# EAGLE schematic blades_v40 (EAGLE 5.09)

## Sheet 1 of 6
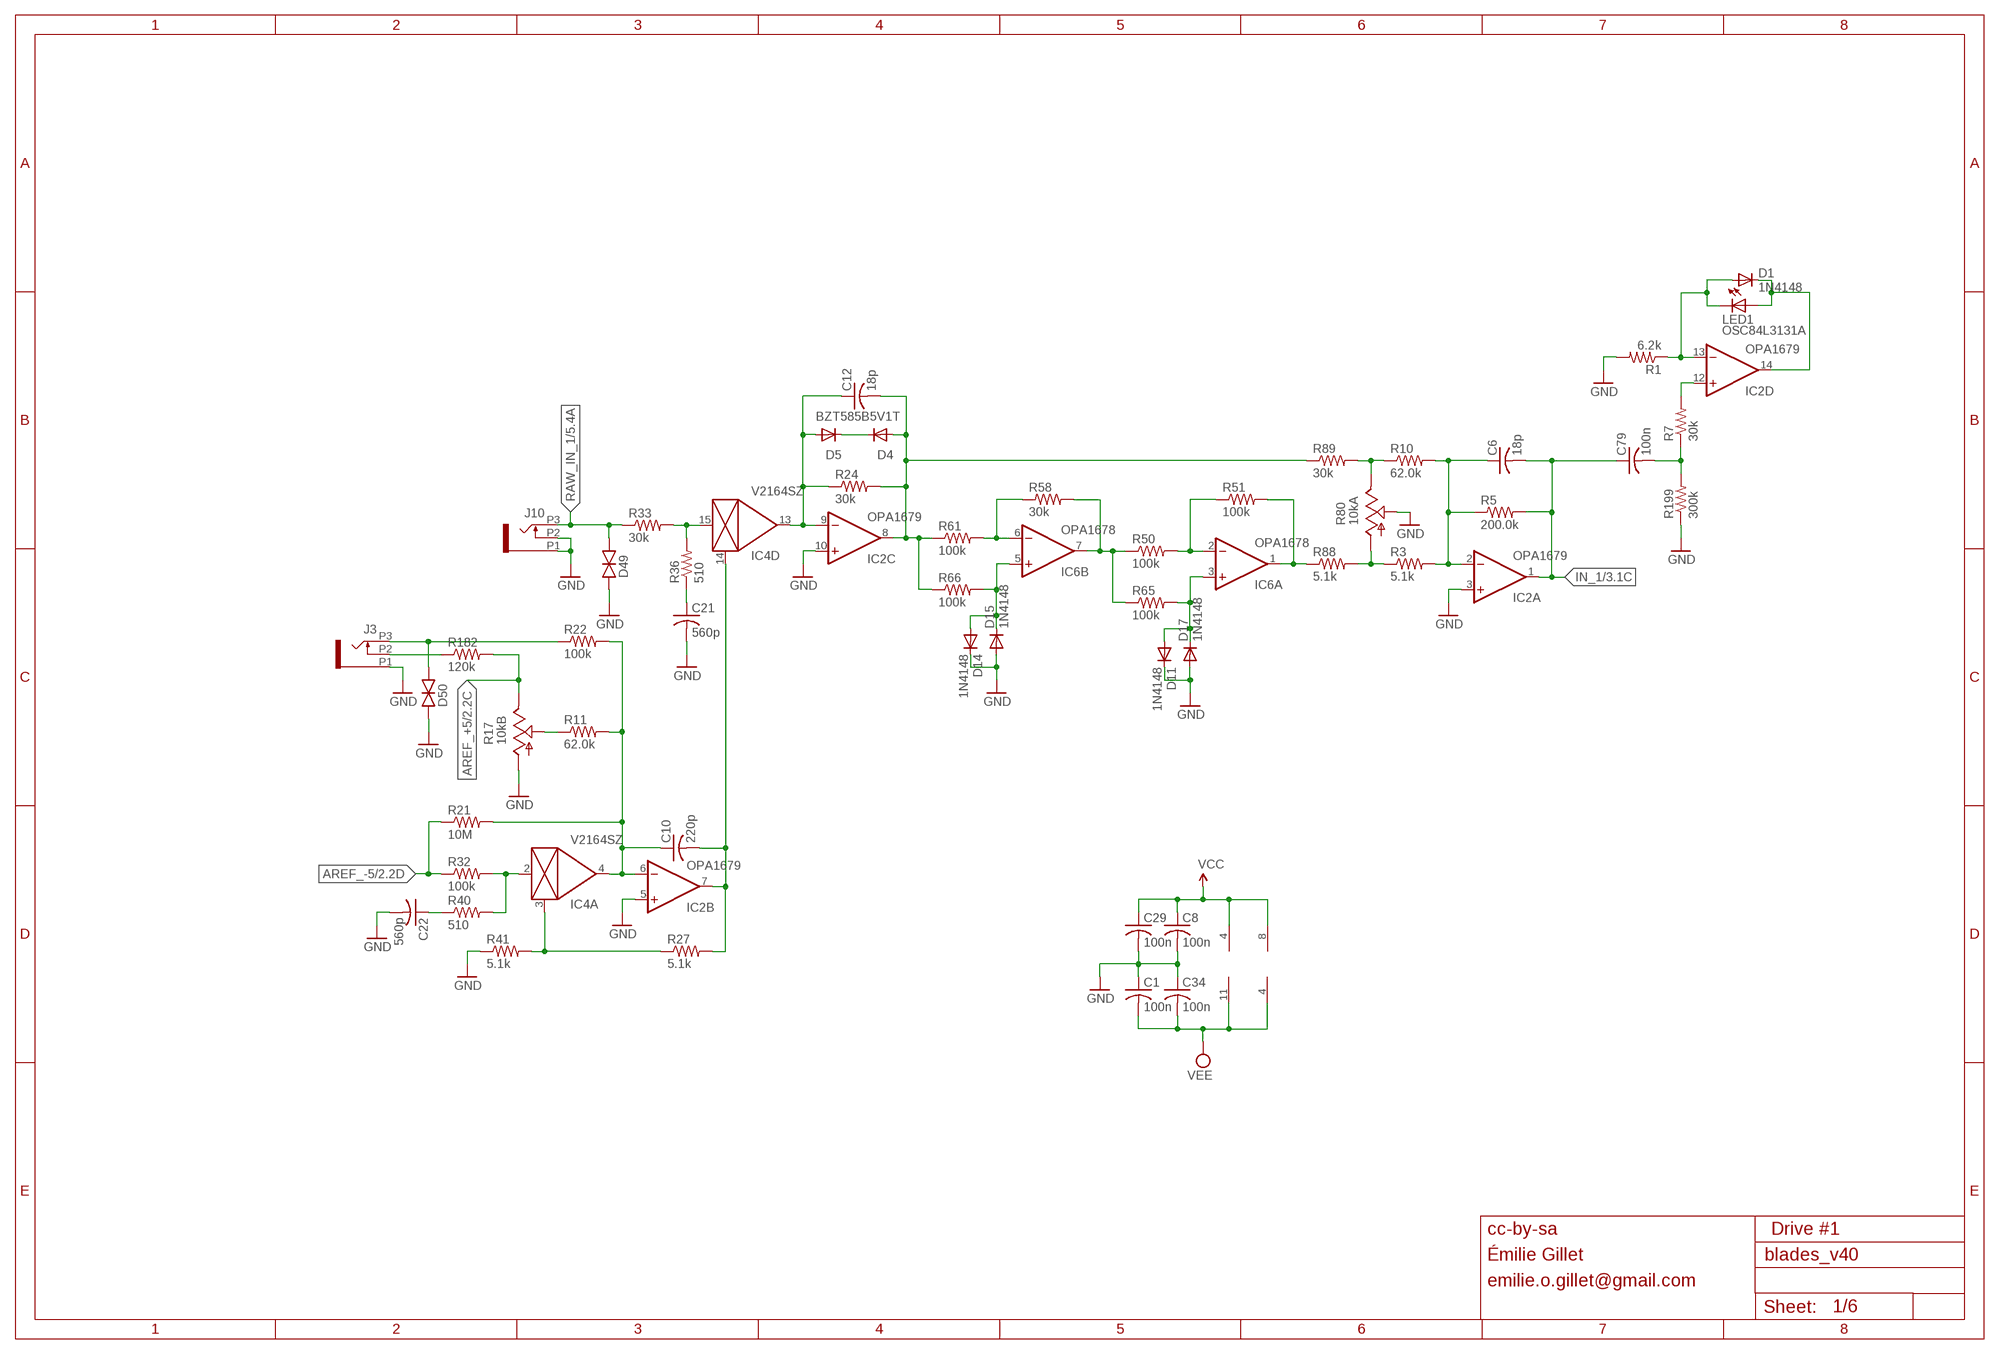
[diagram p0: schematic, sheet 1]

### Parts
C1  100n  C-USC0402  [C0402]
C6  18p  C-USC0402  [C0402]
C8  100n  C-USC0402  [C0402]
C10  220p  C-USC0402  [C0402]
C12  18p  C-USC0402  [C0402]
C21  560p  C-USC0402  [C0402]
C22  560p  C-USC0402  [C0402]
C29  100n  C-USC0402  [C0402]
C34  100n  C-USC0402  [C0402]
C79  100n  C-USC0402  [C0402]
D1  1N4148  DIODE-SOD523  [SOD523]
D4  BZT585B5V1T  DIODE-SOD523  [SOD523]
D5  BZT585B5V1T  DIODE-SOD523  [SOD523]
D11  1N4148  DIODE-SOD523  [SOD523]
D14  1N4148  DIODE-SOD523  [SOD523]
D15  1N4148  DIODE-SOD523  [SOD523]
D17  1N4148  DIODE-SOD523  [SOD523]
D49  TVS  [0603]
D50  TVS  [0603]
IC2  OPA1679  OPA1679PW  [TSSOP14_065]
IC4  V2164SZ  SSM2164S  [SOIC16N]
IC6  OPA1678  OPA1678DGK  [VSSOP8]
J3  PJ301_THONKICONNTME  [WQP_PJ_301M_TME]
J10  PJ301_THONKICONNTME  [WQP_PJ_301M_TME]
LED1  OSC84L3131A  LED3MM  [LED3MM]
R1  6.2k  R-US_R0402  [R0402]
R3  5.1k  R-US_R0402  [R0402]
R5  200.0k  R-US_R0402  [R0402]
R7  30k  R-US_R0402  [R0402]
R10  62.0k  R-US_R0402  [R0402]
R11  62.0k  R-US_R0402  [R0402]
R17  10kB  POT_USVERTICAL_PS  [ALPS_POT_VERTICAL_PS]
R21  10M  R-US_R0402  [R0402]
R22  100k  R-US_R0402  [R0402]
R24  30k  R-US_R0402  [R0402]
R27  5.1k  R-US_R0402  [R0402]
R32  100k  R-US_R0402  [R0402]
R33  30k  R-US_R0402  [R0402]
R36  510  R-US_R0402  [R0402]
R40  510  R-US_R0402  [R0402]
R41  5.1k  R-US_R0402  [R0402]
R50  100k  R-US_R0402  [R0402]
R51  100k  R-US_R0402  [R0402]
R58  30k  R-US_R0402  [R0402]
R61  100k  R-US_R0402  [R0402]
R65  100k  R-US_R0402  [R0402]
R66  100k  R-US_R0402  [R0402]
R80  10kA  POT_USVERTICAL_NARROW  [ALPS_POT_NARROW]
R88  5.1k  R-US_R0402  [R0402]
R89  30k  R-US_R0402  [R0402]
R182  120k  R-US_R0402  [R0402]
R199  300k  R-US_R0402  [R0402]

### Nets
AREF_+5: R17.P$1(E) R182.2 ; also sheet 2,3,4,5,6
AREF_-5: R21.1 R32.1 ; also sheet 2,3,4,5,6
DRIVE_1: C12.2 D4.A IC2.8(C:OUT) R24.2 R61.1 R66.1 R89.1
GND: C1.1 C8.2 C21.2 C22.2 C29.2 C34.1 D11.C D14.C D15.A D17.A D49.1(A) D50.1(A) IC2.3(A:+IN) IC2.5(B:+IN) IC2.10(C:+IN) J3.P1 J10.P1 J10.P2 R1.2 R17.P$3(A) R41.1 R80.P$2(S) R199.1 ; also sheet 2,3,4,5,6
IN_1: C6.2 C79.1 IC2.1(A:OUT) R5.2 ; also sheet 3
MORPH_1A1: C10.2 IC2.7(B:OUT) IC4.14(D:CTRL) R27.2
N$3: D4.C D5.C
N$4: C21.1 R36.1
N$15: C79.2 R7.1 R199.2
N$22: IC4.2(A:IN) R32.2 R40.2
N$31: IC2.12(D:+IN) R7.2
N$38: R10.1 R80.P$1(E) R89.2
N$43: IC6.6(B:-IN) R58.1 R61.2
N$44: D50.2(C) J3.P3 R22.1
N$45: C10.1 IC2.6(B:-IN) IC4.4(A:OUT) R11.2 R21.2 R22.2
N$48: R3.1 R80.P$3(A) R88.2
N$49: C6.1 IC2.2(A:-IN) R3.2 R5.1 R10.2
N$51: R11.1 R17.P$2(S)
N$63: IC4.3(A:CTRL) R27.1 R41.2
N$64: J3.P2 R182.1
N$84: C22.1 R40.1
N$87: IC4.15(D:IN) R33.2 R36.2
N$101: D1.A IC2.13(D:-IN) LED1.K(C) R1.1
N$108: C12.1 D5.A IC2.9(C:-IN) IC4.13(D:OUT) R24.1
N$127: D14.A D15.C IC6.5(B:+IN) R66.2
N$129: D1.C IC2.14(D:OUT) LED1.A
N$185: IC6.7(B:OUT) R50.1 R58.2 R65.1
N$186: IC6.2(A:-IN) R50.2 R51.1
N$187: IC6.1(A:OUT) R51.2 R88.1
N$188: D11.A D17.C IC6.3(A:+IN) R65.2
RAW_IN_1: D49.2(C) J10.P3 R33.1 ; also sheet 5
VCC: C8.1 C29.1 IC2.4(P:V+) IC6.8(P:V+) ; also sheet 2,3,4,5,6
VEE: C1.2 C34.2 IC2.11(P:V-) IC6.4(P:V-) ; also sheet 2,3,4,5,6

### Notes on the sheet
- cc-by-sa | Drive #1
- Émilie Gillet
- emilie.o.gillet@gmail.com

## Sheet 2 of 6
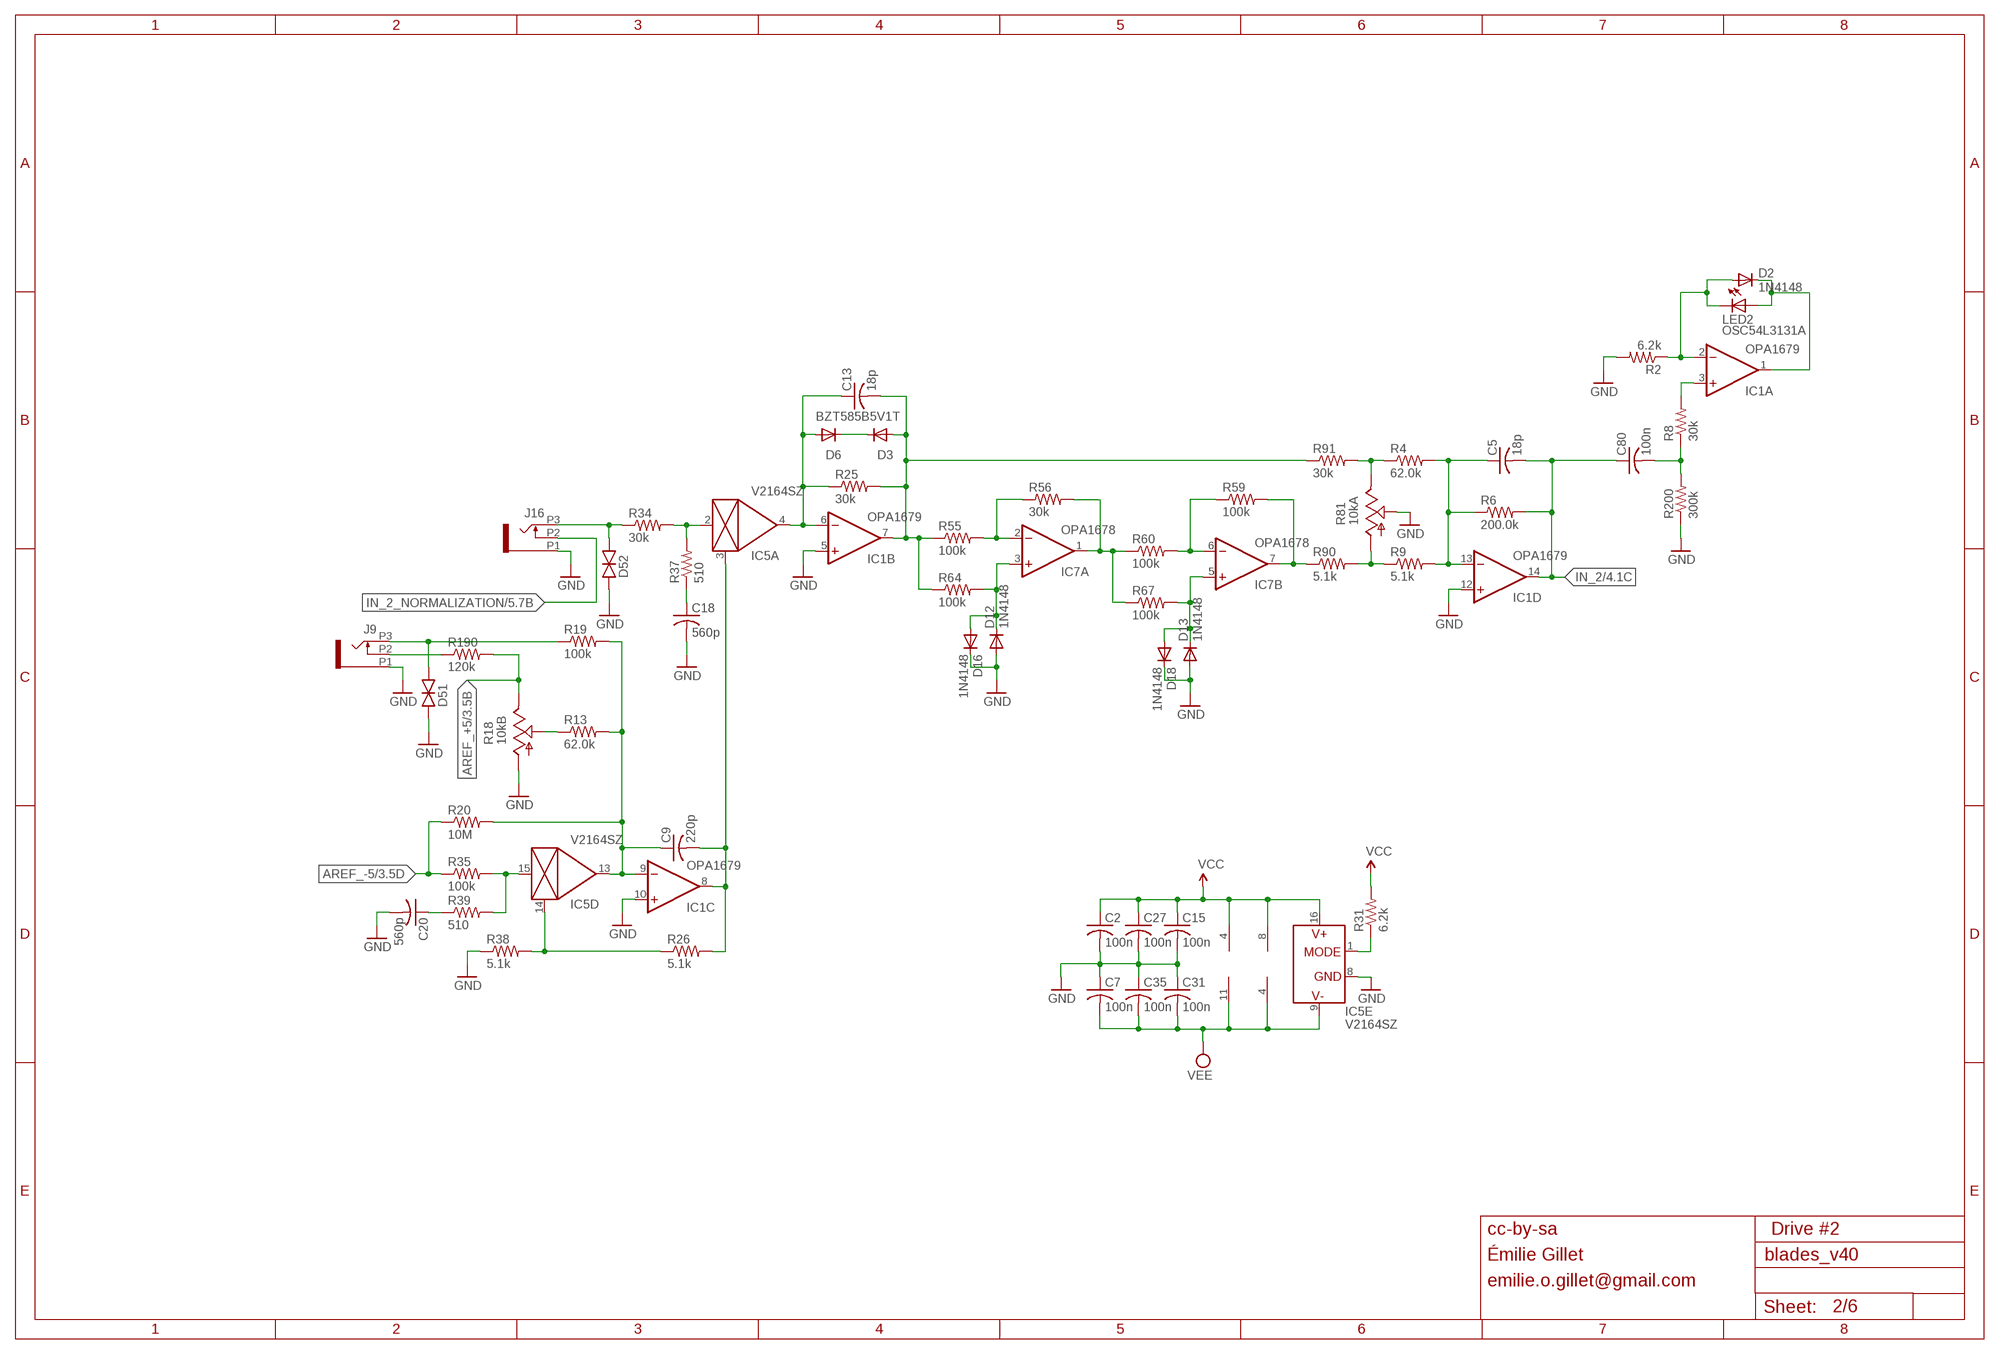
[diagram p1: schematic, sheet 2]

### Parts
C2  100n  C-USC0402  [C0402]
C5  18p  C-USC0402  [C0402]
C7  100n  C-USC0402  [C0402]
C9  220p  C-USC0402  [C0402]
C13  18p  C-USC0402  [C0402]
C15  100n  C-USC0402  [C0402]
C18  560p  C-USC0402  [C0402]
C20  560p  C-USC0402  [C0402]
C27  100n  C-USC0402  [C0402]
C31  100n  C-USC0402  [C0402]
C35  100n  C-USC0402  [C0402]
C80  100n  C-USC0402  [C0402]
D2  1N4148  DIODE-SOD523  [SOD523]
D3  BZT585B5V1T  DIODE-SOD523  [SOD523]
D6  BZT585B5V1T  DIODE-SOD523  [SOD523]
D12  1N4148  DIODE-SOD523  [SOD523]
D13  1N4148  DIODE-SOD523  [SOD523]
D16  1N4148  DIODE-SOD523  [SOD523]
D18  1N4148  DIODE-SOD523  [SOD523]
D51  TVS  [0603]
D52  TVS  [0603]
IC1  OPA1679  OPA1679PW  [TSSOP14_065]
IC5  V2164SZ  SSM2164S  [SOIC16N]
IC7  OPA1678  OPA1678DGK  [VSSOP8]
J9  PJ301_THONKICONNTME  [WQP_PJ_301M_TME]
J16  PJ301_THONKICONNTME  [WQP_PJ_301M_TME]
LED2  OSC54L3131A  LED3MM  [LED3MM]
R2  6.2k  R-US_R0402  [R0402]
R4  62.0k  R-US_R0402  [R0402]
R6  200.0k  R-US_R0402  [R0402]
R8  30k  R-US_R0402  [R0402]
R9  5.1k  R-US_R0402  [R0402]
R13  62.0k  R-US_R0402  [R0402]
R18  10kB  POT_USVERTICAL_PS  [ALPS_POT_VERTICAL_PS]
R19  100k  R-US_R0402  [R0402]
R20  10M  R-US_R0402  [R0402]
R25  30k  R-US_R0402  [R0402]
R26  5.1k  R-US_R0402  [R0402]
R31  6.2k  R-US_R0402  [R0402]
R34  30k  R-US_R0402  [R0402]
R35  100k  R-US_R0402  [R0402]
R37  510  R-US_R0402  [R0402]
R38  5.1k  R-US_R0402  [R0402]
R39  510  R-US_R0402  [R0402]
R55  100k  R-US_R0402  [R0402]
R56  30k  R-US_R0402  [R0402]
R59  100k  R-US_R0402  [R0402]
R60  100k  R-US_R0402  [R0402]
R64  100k  R-US_R0402  [R0402]
R67  100k  R-US_R0402  [R0402]
R81  10kA  POT_USVERTICAL_NARROW  [ALPS_POT_NARROW]
R90  5.1k  R-US_R0402  [R0402]
R91  30k  R-US_R0402  [R0402]
R190  120k  R-US_R0402  [R0402]
R200  300k  R-US_R0402  [R0402]

### Nets
AREF_+5: R18.P$1(E) R190.2 ; also sheet 1,3,4,5,6
AREF_-5: R20.1 R35.1 ; also sheet 1,3,4,5,6
DRIVE_2: C13.2 D3.A IC1.7(B:OUT) R25.2 R55.1 R64.1 R91.1
GND: C2.2 C7.1 C15.2 C18.2 C20.2 C27.2 C31.1 C35.1 D12.A D13.A D16.C D18.C D51.1(A) D52.1(A) IC1.5(B:+IN) IC1.10(C:+IN) IC1.12(D:+IN) IC5.8(E:GND) J9.P1 J16.P1 R2.2 R18.P$3(A) R38.1 R81.P$2(S) R200.1 ; also sheet 1,3,4,5,6
IN_1LED1: IC1.3(A:+IN) R8.2
IN_2: C5.2 C80.1 IC1.14(D:OUT) R6.2 ; also sheet 4
IN_2_NORMALIZATION: J16.P2 ; also sheet 5
MORPH_1A2: C9.2 IC1.8(C:OUT) IC5.3(A:CTRL) R26.2
N$29: D2.A IC1.2(A:-IN) LED2.K(C) R2.1
N$33: R13.1 R18.P$2(S)
N$41: IC7.2(A:-IN) R55.2 R56.1
N$59: D12.C D16.A IC7.3(A:+IN) R64.2
N$68: IC7.1(A:OUT) R56.2 R60.1 R67.1
N$69: IC7.6(B:-IN) R59.1 R60.2
N$70: J9.P2 R190.1
N$82: IC7.7(B:OUT) R59.2 R90.1
N$99: D51.2(C) J9.P3 R19.1
N$100: C5.1 IC1.13(D:-IN) R4.2 R6.1 R9.2
N$107: IC5.1(E:MODE) R31.1
N$116: C80.2 R8.1 R200.2
N$118: D2.C IC1.1(A:OUT) LED2.A
N$119: C9.1 IC1.9(C:-IN) IC5.13(D:OUT) R13.2 R19.2 R20.2
N$120: IC5.14(D:CTRL) R26.1 R38.2
N$121: IC5.15(D:IN) R35.2 R39.2
N$122: C20.1 R39.1
N$123: C18.1 R37.1
N$124: IC5.2(A:IN) R34.2 R37.2
N$126: C13.1 D6.A IC1.6(B:-IN) IC5.4(A:OUT) R25.1
N$154: D13.C D18.A IC7.5(B:+IN) R67.2
N$157: R4.1 R81.P$1(E) R91.2
N$174: R9.1 R81.P$3(A) R90.2
N$182: D3.C D6.C
RAW_IN_2: D52.2(C) J16.P3 R34.1
VCC: C2.1 C15.1 C27.1 IC1.4(P:V+) IC5.16(E:V+) IC7.8(P:V+) R31.2 ; also sheet 1,3,4,5,6
VEE: C7.2 C31.2 C35.2 IC1.11(P:V-) IC5.9(E:V-) IC7.4(P:V-) ; also sheet 1,3,4,5,6

### Notes on the sheet
- cc-by-sa | Drive #2
- Émilie Gillet
- emilie.o.gillet@gmail.com

## Sheet 3 of 6
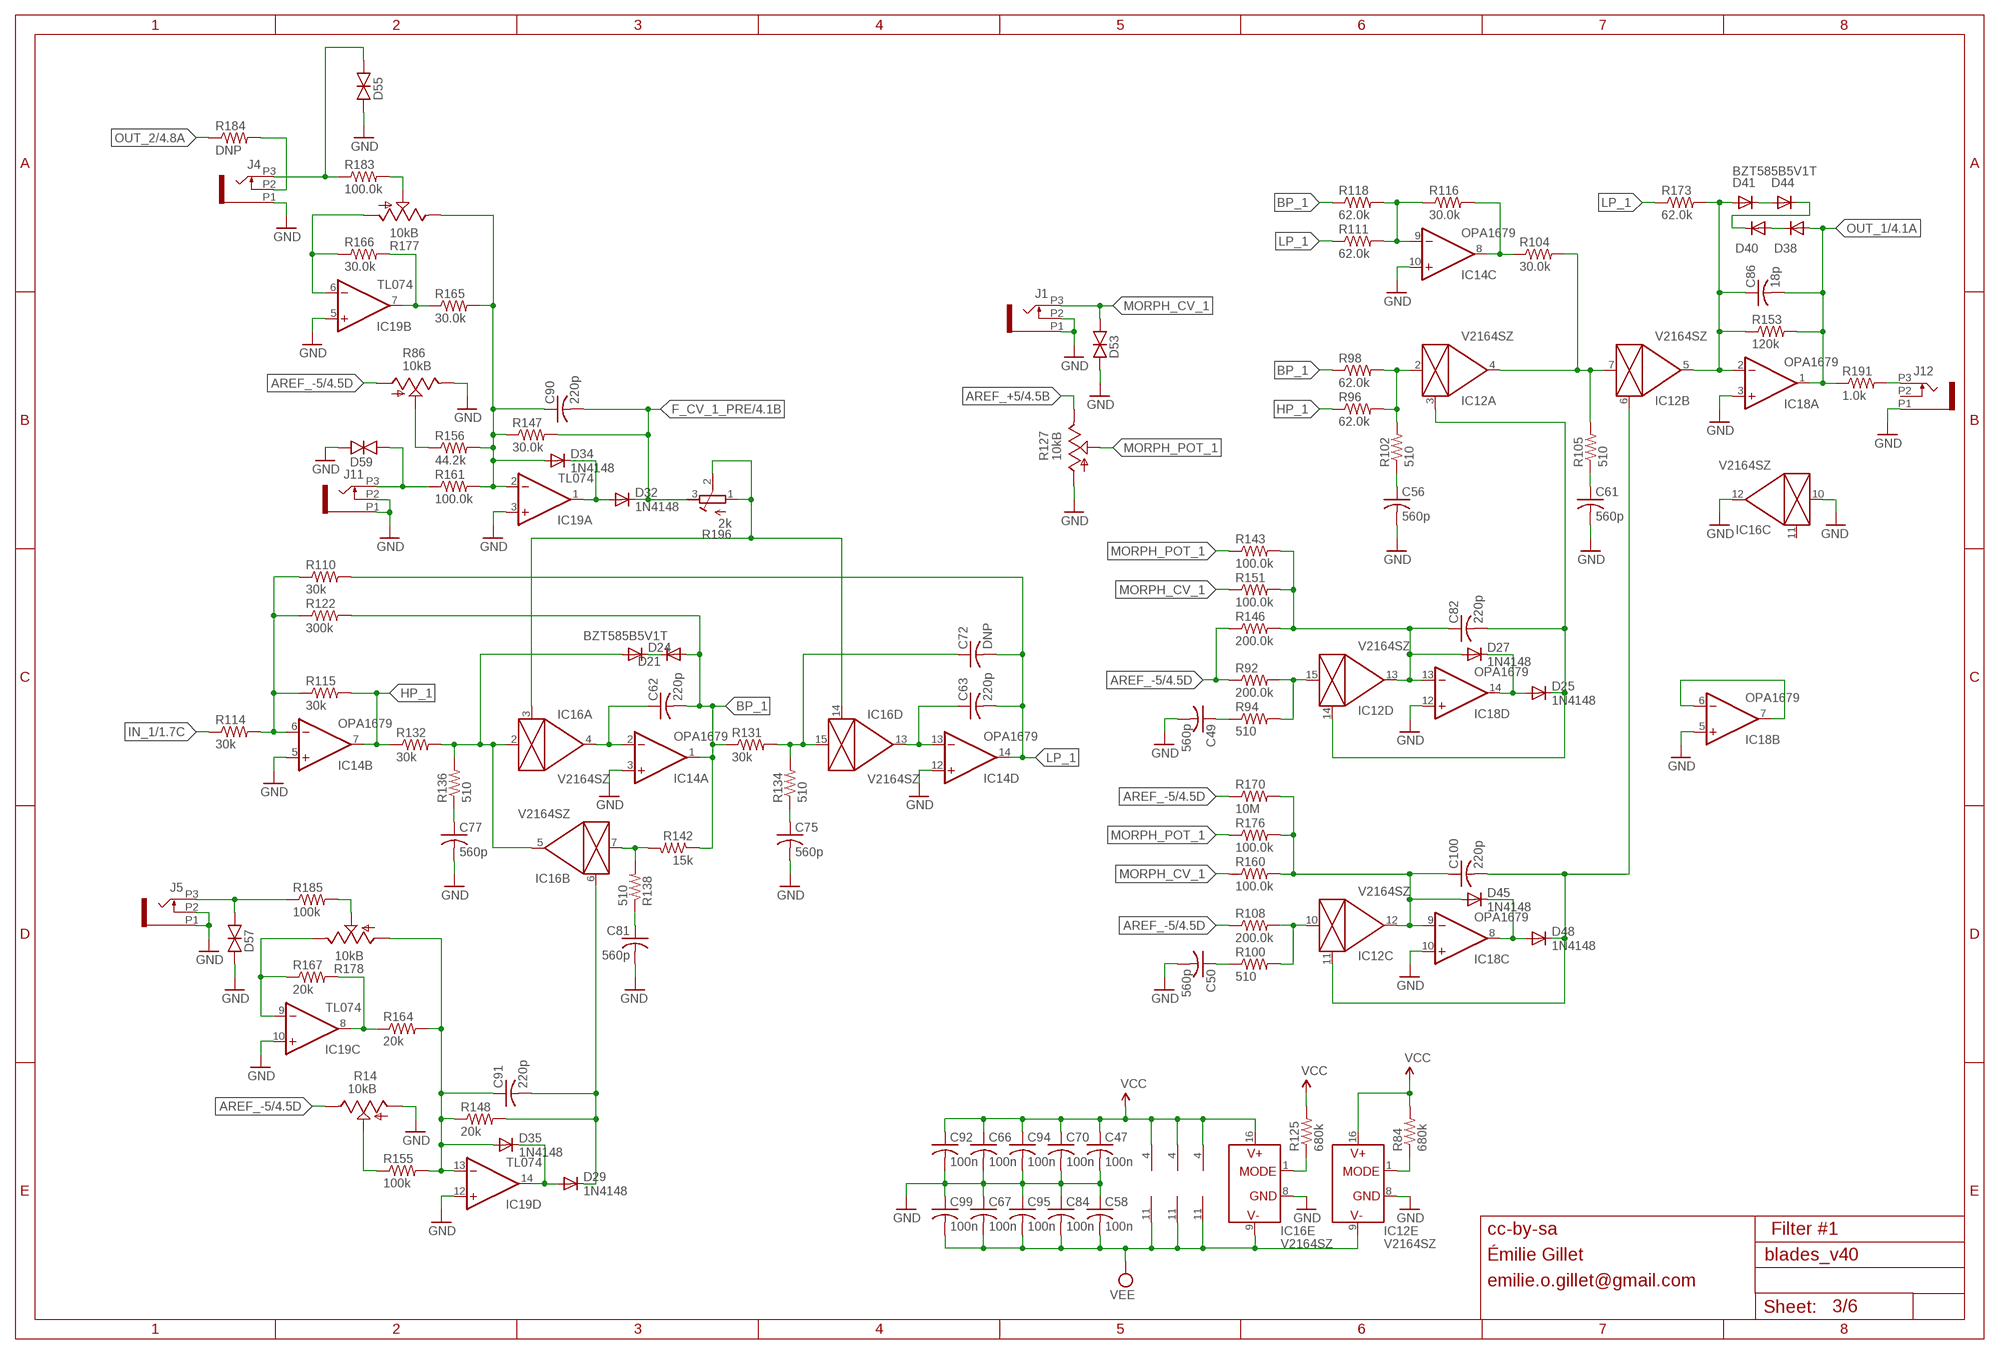
[diagram p2: schematic, sheet 3]

### Parts
C47  100n  C-USC0402  [C0402]
C49  560p  C-USC0402  [C0402]
C50  560p  C-USC0402  [C0402]
C56  560p  C-USC0402  [C0402]
C58  100n  C-USC0402  [C0402]
C61  560p  C-USC0402  [C0402]
C62  220p  C-USC0402  [C0402]
C63  220p  C-USC0402  [C0402]
C66  100n  C-USC0402  [C0402]
C67  100n  C-USC0402  [C0402]
C70  100n  C-USC0402  [C0402]
C72  DNP  C-USC0402  [C0402]
C75  560p  C-USC0402  [C0402]
C77  560p  C-USC0402  [C0402]
C81  560p  C-USC0402  [C0402]
C82  220p  C-USC0402  [C0402]
C84  100n  C-USC0402  [C0402]
C86  18p  C-USC0402  [C0402]
C90  220p  C-USC0402  [C0402]
C91  220p  C-USC0402  [C0402]
C92  100n  C-USC0402  [C0402]
C94  100n  C-USC0402  [C0402]
C95  100n  C-USC0402  [C0402]
C99  100n  C-USC0402  [C0402]
C100  220p  C-USC0402  [C0402]
D21  BZT585B5V1T  DIODE-SOD523  [SOD523]
D24  BZT585B5V1T  DIODE-SOD523  [SOD523]
D25  1N4148  DIODE-SOD523  [SOD523]
D27  1N4148  DIODE-SOD523  [SOD523]
D29  1N4148  DIODE-SOD523  [SOD523]
D32  1N4148  DIODE-SOD523  [SOD523]
D34  1N4148  DIODE-SOD523  [SOD523]
D35  1N4148  DIODE-SOD523  [SOD523]
D38  BZT585B5V1T  DIODE-SOD523  [SOD523]
D40  BZT585B5V1T  DIODE-SOD523  [SOD523]
D41  BZT585B5V1T  DIODE-SOD523  [SOD523]
D44  BZT585B5V1T  DIODE-SOD523  [SOD523]
D45  1N4148  DIODE-SOD523  [SOD523]
D48  1N4148  DIODE-SOD523  [SOD523]
D53  TVS  [0603]
D55  TVS  [0603]
D57  TVS  [0603]
D59  TVS  [0603]
IC12  V2164SZ  SSM2164S  [SOIC16N]
IC14  OPA1679  OPA1679PW  [TSSOP14_065]
IC16  V2164SZ  SSM2164S  [SOIC16N]
IC18  OPA1679  OPA1679PW  [TSSOP14_065]
IC19  TL074  TL074PW  [TSSOP14_065]
J1  PJ301_THONKICONNTME  [WQP_PJ_301M_TME]
J4  PJ301_THONKICONNTME  [WQP_PJ_301M_TME]
J5  PJ301_THONKICONNTME  [WQP_PJ_301M_TME]
J11  PJ301_THONKICONNTME  [WQP_PJ_301M_TME]
J12  PJ301_THONKICONNTME  [WQP_PJ_301M_TME]
R14  10kB  POT_USVERTICAL_PS  [ALPS_POT_VERTICAL_PS]
R84  680k  R-US_R0402  [R0402]
R86  10kB  POT_USVERTICAL_PS  [ALPS_POT_VERTICAL_PS]
R92  200.0k  R-US_R0402  [R0402]
R94  510  R-US_R0402  [R0402]
R96  62.0k  R-US_R0402  [R0402]
R98  62.0k  R-US_R0402  [R0402]
R100  510  R-US_R0402  [R0402]
R102  510  R-US_R0402  [R0402]
R104  30.0k  R-US_R0402  [R0402]
R105  510  R-US_R0402  [R0402]
R108  200.0k  R-US_R0402  [R0402]
R110  30k  R-US_R0402  [R0402]
R111  62.0k  R-US_R0402  [R0402]
R114  30k  R-US_R0402  [R0402]
R115  30k  R-US_R0402  [R0402]
R116  30.0k  R-US_R0402  [R0402]
R118  62.0k  R-US_R0402  [R0402]
R122  300k  R-US_R0402  [R0402]
R125  680k  R-US_R0402  [R0402]
R127  10kB  POT_USVERTICAL_PS  [ALPS_POT_VERTICAL_PS]
R131  30k  R-US_R0402  [R0402]
R132  30k  R-US_R0402  [R0402]
R134  510  R-US_R0402  [R0402]
R136  510  R-US_R0402  [R0402]
R138  510  R-US_R0402  [R0402]
R142  15k  R-US_R0402  [R0402]
R143  100.0k  R-US_R0402  [R0402]
R146  200.0k  R-US_R0402  [R0402]
R147  30.0k  R-US_R0402  [R0402]
R148  20k  R-US_R0402  [R0402]
R151  100.0k  R-US_R0402  [R0402]
R153  120k  R-US_R0402  [R0402]
R155  100k  R-US_R0402  [R0402]
R156  44.2k  R-US_R0402  [R0402]
R160  100.0k  R-US_R0402  [R0402]
R161  100.0k  R-US_R0402  [R0402]
R164  20k  R-US_R0402  [R0402]
R165  30.0k  R-US_R0402  [R0402]
R166  30.0k  R-US_R0402  [R0402]
R167  20k  R-US_R0402  [R0402]
R170  10M  R-US_R0402  [R0402]
R173  62.0k  R-US_R0402  [R0402]
R176  100.0k  R-US_R0402  [R0402]
R177  10kB  POT_USVERTICAL_NARROW  [ALPS_POT_NARROW]
R178  10kB  POT_USVERTICAL_NARROW  [ALPS_POT_NARROW]
R183  100.0k  R-US_R0402  [R0402]
R184  DNP  R-US_R0603  [R0603]
R185  100k  R-US_R0402  [R0402]
R191  1.0k  R-US_R0603  [R0603]
R196  2k  R-TRIMM3296W  [RTRIM3296W]

### Nets
AREF_+5: R127.P$1(E) ; also sheet 1,2,4,5,6
AREF_-5: R14.P$1(E) R86.P$3(A) R92.1 R108.1 R146.1 R170.1 ; also sheet 1,2,4,5,6
BP_1: C62.2 D21.A IC14.1(A:OUT) R98.1 R118.1 R122.2 R131.1 R142.1
F_CV_1: IC16.3(A:CTRL) IC16.14(D:CTRL) R196.1(E) R196.2(S)
F_CV_1_PRE: C90.2 D32.C R147.2 R196.3(A) ; also sheet 4
GND: C47.2 C49.2 C50.2 C56.2 C58.1 C61.2 C66.2 C67.1 C70.2 C75.2 C77.2 C81.2 C84.1 C92.2 C94.2 C95.1 C99.1 D53.1(A) D55.1(A) D57.1(A) D59.1(A) IC12.8(E:GND) IC14.3(A:+IN) IC14.5(B:+IN) IC14.10(C:+IN) IC14.12(D:+IN) IC16.8(E:GND) IC16.10(C:IN) IC16.12(C:OUT) IC18.3(A:+IN) IC18.5(B:+IN) IC18.10(C:+IN) IC18.12(D:+IN) IC19.3(A:+IN) IC19.5(B:+IN) IC19.10(C:+IN) IC19.12(D:+IN) J1.P1 J1.P2 J4.P1 J5.P1 J5.P2 J11.P1 J11.P2 J12.P1 R14.P$3(A) R86.P$1(E) R127.P$3(A) ; also sheet 1,2,4,5,6
HP_1: IC14.7(B:OUT) R96.1 R115.2 R132.1
IN_1: R114.1 ; also sheet 1
LP_1: C63.2 C72.2 IC14.14(D:OUT) R110.2 R111.1 R173.1
MORPH_1A: C82.2 D25.C IC12.3(A:CTRL) IC12.14(D:CTRL)
MORPH_1B: C100.2 D48.C IC12.6(B:CTRL) IC12.11(C:CTRL)
MORPH_CV_1: D53.2(C) J1.P3 R151.1 R160.1
MORPH_POT_1: R127.P$2(S) R143.1 R176.1
N$7: C77.1 R136.1
N$8: J12.P3 R191.2
N$12: C90.1 D34.A IC19.2(A:-IN) R147.1 R156.2 R161.2 R165.2 R177.P$1(E)
N$20: C91.1 D35.A IC19.13(D:-IN) R148.1 R155.2 R164.2 R178.P$3(A)
N$21: D32.A D34.C IC19.1(A:OUT)
N$25: R86.P$2(S) R156.1
N$28: IC19.9(C:-IN) R167.1 R178.P$1(E)
N$30: IC19.8(C:OUT) R164.1 R167.2
N$32: R178.P$2(S) R185.2
N$35: C100.1 D45.A IC12.12(C:OUT) IC18.9(C:-IN) R160.2 R170.2 R176.2
N$36: IC14.6(B:-IN) R110.1 R114.2 R115.1 R122.1
N$39: C62.1 IC14.2(A:-IN) IC16.4(A:OUT)
N$40: C75.1 R134.1
N$42: C72.1 IC16.15(D:IN) R131.2 R134.2
N$46: C63.1 IC14.13(D:-IN) IC16.13(D:OUT)
N$47: C81.1 R138.1
N$50: IC16.7(B:IN) R138.2 R142.2
N$52: D57.2(C) J5.P3 R185.1
N$55: D29.A D35.C IC19.14(D:OUT)
N$57: IC18.6(B:-IN) IC18.7(B:OUT)
N$60: J4.P2 R184.2
N$66: R14.P$2(S) R155.1
N$72: IC12.2(A:IN) R96.2 R98.2 R102.2
N$73: IC14.9(C:-IN) R111.2 R116.1 R118.2
N$74: IC14.8(C:OUT) R104.1 R116.2
N$78: IC12.4(A:OUT) IC12.7(B:IN) R104.2 R105.2
N$79: C56.1 R102.1
N$80: C61.1 R105.1
N$81: D45.C D48.A IC18.8(C:OUT)
N$86: IC12.10(C:IN) R100.2 R108.2
N$88: IC19.6(B:-IN) R166.1 R177.P$3(A)
N$89: IC19.7(B:OUT) R165.1 R166.2
N$90: R177.P$2(S) R183.2
N$92: D55.2(C) J4.P3 R183.1
N$93: D59.2(C) J11.P3 R161.1
N$103: C50.1 R100.1
N$104: IC12.15(D:IN) R92.2 R94.2
N$105: C49.1 R94.1
N$109: C82.1 D27.A IC12.13(D:OUT) IC18.13(D:-IN) R143.2 R146.2 R151.2
N$110: D25.A D27.C IC18.14(D:OUT)
N$111: IC12.1(E:MODE) R84.1
N$112: IC16.1(E:MODE) R125.1
N$113: D21.C D24.C
N$114: C86.1 D41.A IC12.5(B:OUT) IC18.2(A:-IN) R153.1 R173.2
N$115: D38.C D40.A
N$128: D24.A IC16.2(A:IN) IC16.5(B:OUT) R132.2 R136.2
N$189: D40.C D44.C
N$190: D41.C D44.A
OUT_1: C86.2 D38.A IC18.1(A:OUT) R153.2 R191.1 ; also sheet 4,5
OUT_2: R184.1 ; also sheet 4,5
RESONANCE_SUM_1: C91.2 D29.C IC16.6(B:CTRL) R148.2
VCC: C47.1 C66.1 C70.1 C92.1 C94.1 IC12.16(E:V+) IC14.4(P:V+) IC16.16(E:V+) IC18.4(P:V+) IC19.4(P:V+) R84.2 R125.2 ; also sheet 1,2,4,5,6
VEE: C58.2 C67.2 C84.2 C95.2 C99.2 IC12.9(E:V-) IC14.11(P:V-) IC16.9(E:V-) IC18.11(P:V-) IC19.11(P:V-) ; also sheet 1,2,4,5,6
Unconnected: IC16.11(C:CTRL) J12.P2

### Notes on the sheet
- cc-by-sa | Filter #1
- Émilie Gillet
- emilie.o.gillet@gmail.com

## Sheet 4 of 6
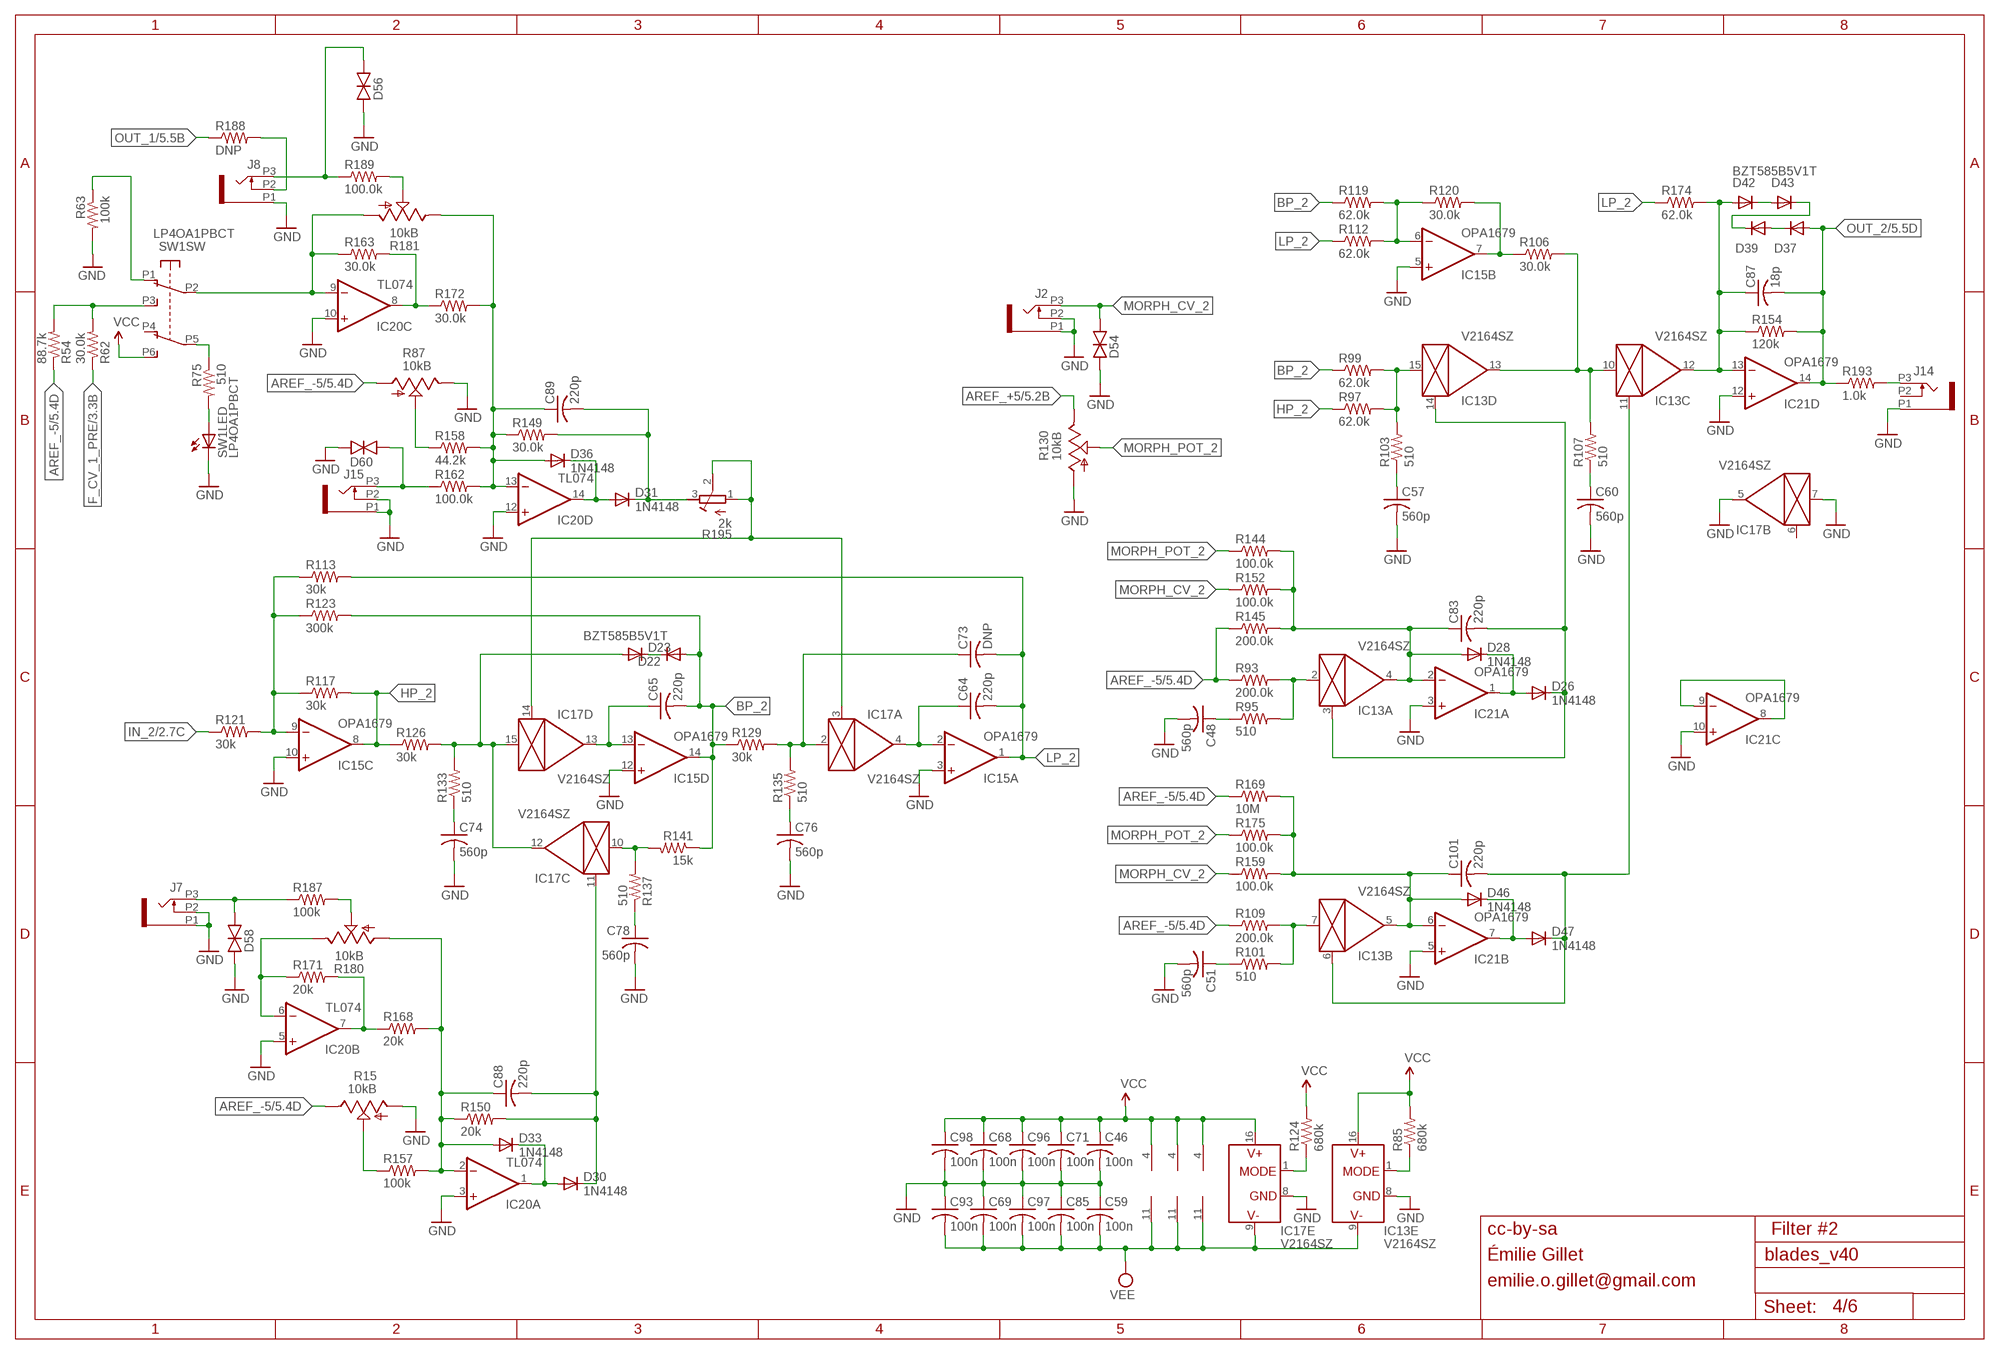
[diagram p3: schematic, sheet 4]

### Parts
C46  100n  C-USC0402  [C0402]
C48  560p  C-USC0402  [C0402]
C51  560p  C-USC0402  [C0402]
C57  560p  C-USC0402  [C0402]
C59  100n  C-USC0402  [C0402]
C60  560p  C-USC0402  [C0402]
C64  220p  C-USC0402  [C0402]
C65  220p  C-USC0402  [C0402]
C68  100n  C-USC0402  [C0402]
C69  100n  C-USC0402  [C0402]
C71  100n  C-USC0402  [C0402]
C73  DNP  C-USC0402  [C0402]
C74  560p  C-USC0402  [C0402]
C76  560p  C-USC0402  [C0402]
C78  560p  C-USC0402  [C0402]
C83  220p  C-USC0402  [C0402]
C85  100n  C-USC0402  [C0402]
C87  18p  C-USC0402  [C0402]
C88  220p  C-USC0402  [C0402]
C89  220p  C-USC0402  [C0402]
C93  100n  C-USC0402  [C0402]
C96  100n  C-USC0402  [C0402]
C97  100n  C-USC0402  [C0402]
C98  100n  C-USC0402  [C0402]
C101  220p  C-USC0402  [C0402]
D22  BZT585B5V1T  DIODE-SOD523  [SOD523]
D23  BZT585B5V1T  DIODE-SOD523  [SOD523]
D26  1N4148  DIODE-SOD523  [SOD523]
D28  1N4148  DIODE-SOD523  [SOD523]
D30  1N4148  DIODE-SOD523  [SOD523]
D31  1N4148  DIODE-SOD523  [SOD523]
D33  1N4148  DIODE-SOD523  [SOD523]
D36  1N4148  DIODE-SOD523  [SOD523]
D37  BZT585B5V1T  DIODE-SOD523  [SOD523]
D39  BZT585B5V1T  DIODE-SOD523  [SOD523]
D42  BZT585B5V1T  DIODE-SOD523  [SOD523]
D43  BZT585B5V1T  DIODE-SOD523  [SOD523]
D46  1N4148  DIODE-SOD523  [SOD523]
D47  1N4148  DIODE-SOD523  [SOD523]
D54  TVS  [0603]
D56  TVS  [0603]
D58  TVS  [0603]
D60  TVS  [0603]
IC13  V2164SZ  SSM2164S  [SOIC16N]
IC15  OPA1679  OPA1679PW  [TSSOP14_065]
IC17  V2164SZ  SSM2164S  [SOIC16N]
IC20  TL074  TL074PW  [TSSOP14_065]
IC21  OPA1679  OPA1679PW  [TSSOP14_065]
J2  PJ301_THONKICONNTME  [WQP_PJ_301M_TME]
J7  PJ301_THONKICONNTME  [WQP_PJ_301M_TME]
J8  PJ301_THONKICONNTME  [WQP_PJ_301M_TME]
J14  PJ301_THONKICONNTME  [WQP_PJ_301M_TME]
J15  PJ301_THONKICONNTME  [WQP_PJ_301M_TME]
R15  10kB  POT_USVERTICAL_PS  [ALPS_POT_VERTICAL_PS]
R54  88.7k  R-US_R0402  [R0402]
R62  30.0k  R-US_R0402  [R0402]
R63  100k  R-US_R0402  [R0402]
R75  510  R-US_R0402  [R0402]
R85  680k  R-US_R0402  [R0402]
R87  10kB  POT_USVERTICAL_PS  [ALPS_POT_VERTICAL_PS]
R93  200.0k  R-US_R0402  [R0402]
R95  510  R-US_R0402  [R0402]
R97  62.0k  R-US_R0402  [R0402]
R99  62.0k  R-US_R0402  [R0402]
R101  510  R-US_R0402  [R0402]
R103  510  R-US_R0402  [R0402]
R106  30.0k  R-US_R0402  [R0402]
R107  510  R-US_R0402  [R0402]
R109  200.0k  R-US_R0402  [R0402]
R112  62.0k  R-US_R0402  [R0402]
R113  30k  R-US_R0402  [R0402]
R117  30k  R-US_R0402  [R0402]
R119  62.0k  R-US_R0402  [R0402]
R120  30.0k  R-US_R0402  [R0402]
R121  30k  R-US_R0402  [R0402]
R123  300k  R-US_R0402  [R0402]
R124  680k  R-US_R0402  [R0402]
R126  30k  R-US_R0402  [R0402]
R129  30k  R-US_R0402  [R0402]
R130  10kB  POT_USVERTICAL_PS  [ALPS_POT_VERTICAL_PS]
R133  510  R-US_R0402  [R0402]
R135  510  R-US_R0402  [R0402]
R137  510  R-US_R0402  [R0402]
R141  15k  R-US_R0402  [R0402]
R144  100.0k  R-US_R0402  [R0402]
R145  200.0k  R-US_R0402  [R0402]
R149  30.0k  R-US_R0402  [R0402]
R150  20k  R-US_R0402  [R0402]
R152  100.0k  R-US_R0402  [R0402]
R154  120k  R-US_R0402  [R0402]
R157  100k  R-US_R0402  [R0402]
R158  44.2k  R-US_R0402  [R0402]
R159  100.0k  R-US_R0402  [R0402]
R162  100.0k  R-US_R0402  [R0402]
R163  30.0k  R-US_R0402  [R0402]
R168  20k  R-US_R0402  [R0402]
R169  10M  R-US_R0402  [R0402]
R171  20k  R-US_R0402  [R0402]
R172  30.0k  R-US_R0402  [R0402]
R174  62.0k  R-US_R0402  [R0402]
R175  100.0k  R-US_R0402  [R0402]
R180  10kB  POT_USVERTICAL_NARROW  [ALPS_POT_NARROW]
R181  10kB  POT_USVERTICAL_NARROW  [ALPS_POT_NARROW]
R187  100k  R-US_R0402  [R0402]
R188  DNP  R-US_R0603  [R0603]
R189  100.0k  R-US_R0402  [R0402]
R193  1.0k  R-US_R0603  [R0603]
R195  2k  R-TRIMM3296W  [RTRIM3296W]
SW1  LP4OA1PBCT  [LP4OA1PBCT]

### Nets
AREF_+5: R130.P$1(E) ; also sheet 1,2,3,5,6
AREF_-5: R15.P$1(E) R54.1 R87.P$3(A) R93.1 R109.1 R145.1 R169.1 ; also sheet 1,2,3,5,6
BP_2: C65.2 D22.A IC15.14(D:OUT) R99.1 R119.1 R123.2 R129.1 R141.1
F_CV_1_PRE: R62.1 ; also sheet 3
F_CV_2: IC17.3(A:CTRL) IC17.14(D:CTRL) R195.1(E) R195.2(S)
GND: C46.2 C48.2 C51.2 C57.2 C59.1 C60.2 C68.2 C69.1 C71.2 C74.2 C76.2 C78.2 C85.1 C93.1 C96.2 C97.1 C98.2 D54.1(A) D56.1(A) D58.1(A) D60.1(A) IC13.8(E:GND) IC15.3(A:+IN) IC15.5(B:+IN) IC15.10(C:+IN) IC15.12(D:+IN) IC17.5(B:OUT) IC17.7(B:IN) IC17.8(E:GND) IC20.3(A:+IN) IC20.5(B:+IN) IC20.10(C:+IN) IC20.12(D:+IN) IC21.3(A:+IN) IC21.5(B:+IN) IC21.10(C:+IN) IC21.12(D:+IN) J2.P1 J2.P2 J7.P1 J7.P2 J8.P1 J14.P1 J15.P1 J15.P2 R15.P$3(A) R63.2 R87.P$1(E) R130.P$3(A) SW1.L2(LED:L2) ; also sheet 1,2,3,5,6
HP_2: IC15.8(C:OUT) R97.1 R117.2 R126.1
IN_2: R121.1 ; also sheet 2
LP_2: C64.2 C73.2 IC15.1(A:OUT) R112.1 R113.2 R174.1
MORPH_1A3: C83.2 D26.C IC13.3(A:CTRL) IC13.14(D:CTRL)
MORPH_1B1: C101.2 D47.C IC13.6(B:CTRL) IC13.11(C:CTRL)
MORPH_CV_2: D54.2(C) J2.P3 R152.1 R159.1
MORPH_POT_2: R130.P$2(S) R144.1 R175.1
N$24: IC21.8(C:OUT) IC21.9(C:-IN)
N$27: R75.1 SW1.P5(SW:B2)
N$37: D23.A IC17.12(C:OUT) IC17.15(D:IN) R126.2 R133.2
N$56: C89.2 D31.C R149.2 R195.3(A)
N$61: J8.P2 R188.2
N$71: C87.1 D42.A IC13.12(C:OUT) IC21.13(D:-IN) R154.1 R174.2
N$77: C88.2 D30.C IC17.11(C:CTRL) R150.2
N$95: D37.C D39.A
N$97: R75.2 SW1.L1(LED:L1)
N$125: R63.1 SW1.P1(SW:A1)
N$132: C74.1 R133.1
N$133: IC15.9(C:-IN) R113.1 R117.1 R121.2 R123.1
N$135: C65.1 IC15.13(D:-IN) IC17.13(D:OUT)
N$136: C76.1 R135.1
N$137: C73.1 IC17.2(A:IN) R129.2 R135.2
N$138: C64.1 IC15.2(A:-IN) IC17.4(A:OUT)
N$139: C78.1 R137.1
N$140: IC17.10(C:IN) R137.2 R141.2
N$141: IC13.15(D:IN) R97.2 R99.2 R103.2
N$142: IC15.6(B:-IN) R112.2 R119.2 R120.1
N$143: IC15.7(B:OUT) R106.1 R120.2
N$145: IC13.10(C:IN) IC13.13(D:OUT) R106.2 R107.2
N$146: C57.1 R103.1
N$147: C60.1 R107.1
N$148: IC20.9(C:-IN) R163.1 R181.P$3(A) SW1.P2(SW:A2)
N$149: IC20.8(C:OUT) R163.2 R172.1
N$150: R181.P$2(S) R189.2
N$151: D56.2(C) J8.P3 R189.1
N$152: D60.2(C) J15.P3 R162.1
N$153: D30.A D33.C IC20.1(A:OUT)
N$155: J14.P3 R193.2
N$156: R87.P$2(S) R158.1
N$161: IC20.6(B:-IN) R171.1 R180.P$1(E)
N$162: IC20.7(B:OUT) R168.1 R171.2
N$163: R180.P$2(S) R187.2
N$164: D58.2(C) J7.P3 R187.1
N$165: R15.P$2(S) R157.1
N$166: R54.2 R62.2 SW1.P3(SW:A3)
N$167: C88.1 D33.A IC20.2(A:-IN) R150.1 R157.2 R168.2 R180.P$3(A)
N$168: C89.1 D36.A IC20.13(D:-IN) R149.1 R158.2 R162.2 R172.2 R181.P$1(E)
N$169: C83.1 D28.A IC13.4(A:OUT) IC21.2(A:-IN) R144.2 R145.2 R152.2
N$170: D26.A D28.C IC21.1(A:OUT)
N$171: C101.1 D46.A IC13.5(B:OUT) IC21.6(B:-IN) R159.2 R169.2 R175.2
N$172: D46.C D47.A IC21.7(B:OUT)
N$173: D31.A D36.C IC20.14(D:OUT)
N$176: IC13.7(B:IN) R101.2 R109.2
N$177: C51.1 R101.1
N$178: IC13.2(A:IN) R93.2 R95.2
N$179: C48.1 R95.1
N$180: IC13.1(E:MODE) R85.1
N$181: IC17.1(E:MODE) R124.1
N$183: D22.C D23.C
N$191: D42.C D43.A
N$192: D39.C D43.C
OUT_1: R188.1 ; also sheet 3,5
OUT_2: C87.2 D37.A IC21.14(D:OUT) R154.2 R193.1 ; also sheet 3,5
VCC: C46.1 C68.1 C71.1 C96.1 C98.1 IC13.16(E:V+) IC15.4(P:V+) IC17.16(E:V+) IC20.4(P:V+) IC21.4(P:V+) R85.2 R124.2 SW1.P6(SW:B3) ; also sheet 1,2,3,5,6
VEE: C59.2 C69.2 C85.2 C93.2 C97.2 IC13.9(E:V-) IC15.11(P:V-) IC17.9(E:V-) IC20.11(P:V-) IC21.11(P:V-) ; also sheet 1,2,3,5,6
Unconnected: IC17.6(B:CTRL) J14.P2 SW1.P4(SW:B1)

### Notes on the sheet
- cc-by-sa | Filter #2
- Émilie Gillet
- emilie.o.gillet@gmail.com

## Sheet 5 of 6
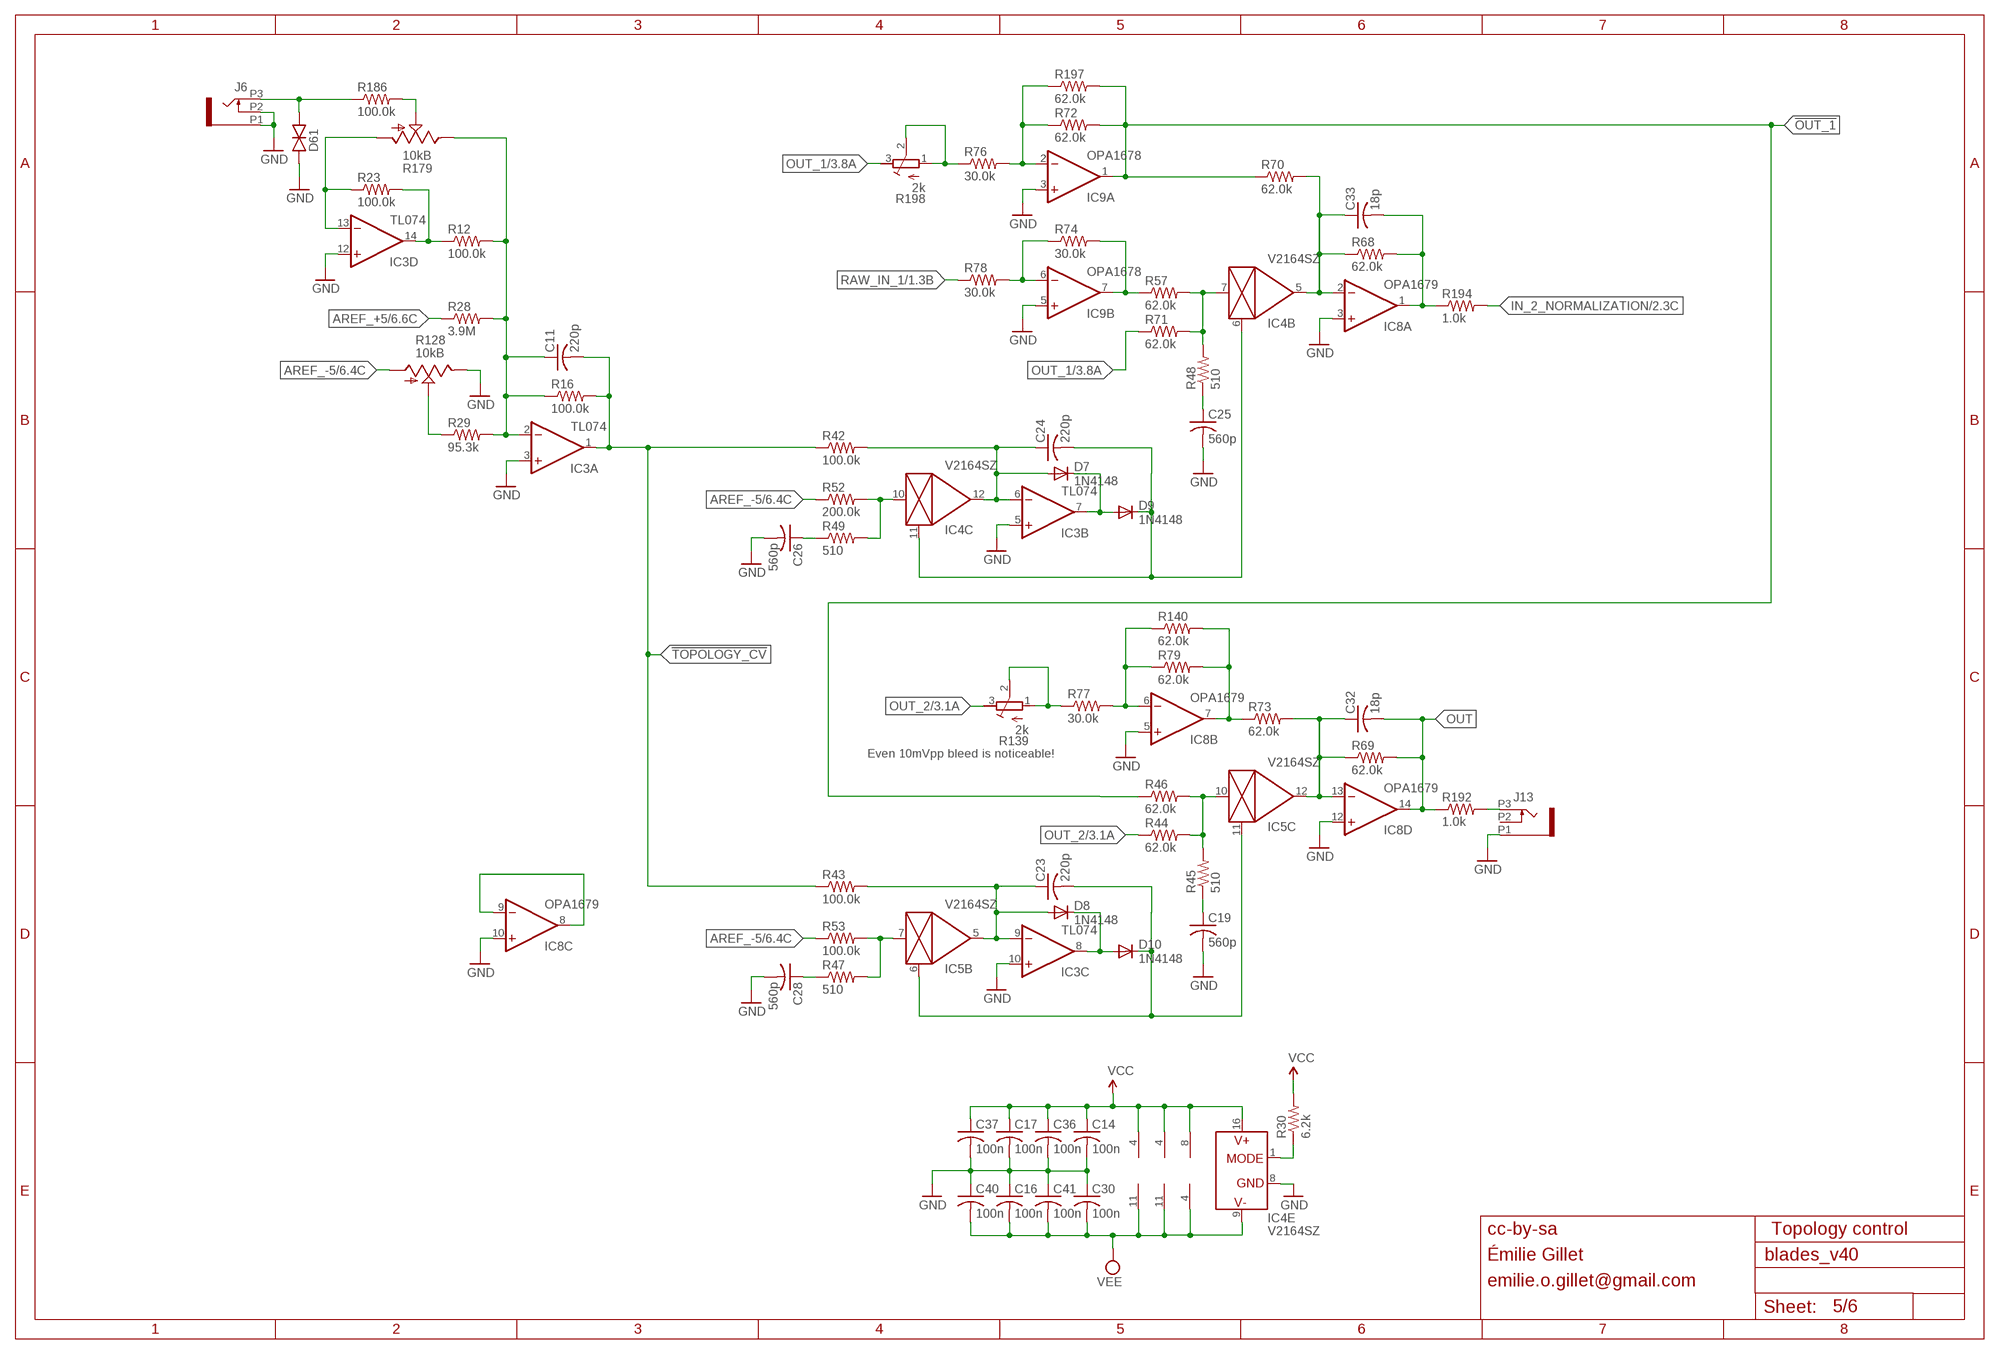
[diagram p4: schematic, sheet 5]

### Parts
C11  220p  C-USC0402  [C0402]
C14  100n  C-USC0402  [C0402]
C16  100n  C-USC0402  [C0402]
C17  100n  C-USC0402  [C0402]
C19  560p  C-USC0402  [C0402]
C23  220p  C-USC0402  [C0402]
C24  220p  C-USC0402  [C0402]
C25  560p  C-USC0402  [C0402]
C26  560p  C-USC0402  [C0402]
C28  560p  C-USC0402  [C0402]
C30  100n  C-USC0402  [C0402]
C32  18p  C-USC0402  [C0402]
C33  18p  C-USC0402  [C0402]
C36  100n  C-USC0402  [C0402]
C37  100n  C-USC0402  [C0402]
C40  100n  C-USC0402  [C0402]
C41  100n  C-USC0402  [C0402]
D7  1N4148  DIODE-SOD523  [SOD523]
D8  1N4148  DIODE-SOD523  [SOD523]
D9  1N4148  DIODE-SOD523  [SOD523]
D10  1N4148  DIODE-SOD523  [SOD523]
D61  TVS  [0603]
IC3  TL074  TL074PW  [TSSOP14_065]
IC8  OPA1679  OPA1679PW  [TSSOP14_065]
IC9  OPA1678  OPA1678DGK  [VSSOP8]
J6  PJ301_THONKICONNTME  [WQP_PJ_301M_TME]
J13  PJ301_THONKICONNTME  [WQP_PJ_301M_TME]
R12  100.0k  R-US_R0402  [R0402]
R16  100.0k  R-US_R0402  [R0402]
R23  100.0k  R-US_R0402  [R0402]
R28  3.9M  R-US_R0402  [R0402]
R29  95.3k  R-US_R0402  [R0402]
R30  6.2k  R-US_R0402  [R0402]
R42  100.0k  R-US_R0402  [R0402]
R43  100.0k  R-US_R0402  [R0402]
R44  62.0k  R-US_R0402  [R0402]
R45  510  R-US_R0402  [R0402]
R46  62.0k  R-US_R0402  [R0402]
R47  510  R-US_R0402  [R0402]
R48  510  R-US_R0402  [R0402]
R49  510  R-US_R0402  [R0402]
R52  200.0k  R-US_R0402  [R0402]
R53  100.0k  R-US_R0402  [R0402]
R57  62.0k  R-US_R0402  [R0402]
R68  62.0k  R-US_R0402  [R0402]
R69  62.0k  R-US_R0402  [R0402]
R70  62.0k  R-US_R0402  [R0402]
R71  62.0k  R-US_R0402  [R0402]
R72  62.0k  R-US_R0402  [R0402]
R73  62.0k  R-US_R0402  [R0402]
R74  30.0k  R-US_R0402  [R0402]
R76  30.0k  R-US_R0402  [R0402]
R77  30.0k  R-US_R0402  [R0402]
R78  30.0k  R-US_R0402  [R0402]
R79  62.0k  R-US_R0402  [R0402]
R128  10kB  POT_USVERTICAL_PS  [ALPS_POT_VERTICAL_PS]
R139  2k  R-TRIMM3296W  [RTRIM3296W]
R140  62.0k  R-US_R0402  [R0402]
R179  10kB  POT_USVERTICAL_NARROW  [ALPS_POT_NARROW]
R186  100.0k  R-US_R0402  [R0402]
R192  1.0k  R-US_R0603  [R0603]
R194  1.0k  R-US_R0603  [R0603]
R197  62.0k  R-US_R0402  [R0402]
R198  2k  R-TRIMM3296W  [RTRIM3296W]

### Nets
!OUT_1: IC9.1(A:OUT) R46.1 R70.1 R72.2 R197.2
!TOPOLOGY_CV: C11.2 IC3.1(A:OUT) R16.2 R42.1 R43.1
AREF_+5: R28.1 ; also sheet 1,2,3,4,6
AREF_-5: R52.1 R53.1 R128.P$3(A) ; also sheet 1,2,3,4,6
F1: C24.2 D9.C IC4.6(B:CTRL) IC4.11(C:CTRL)
F2: C23.2 D10.C IC5.6(B:CTRL) IC5.11(C:CTRL)
F_CV_3: R77.1 R139.1(E) R139.2(S)
GND: C14.2 C16.1 C17.2 C19.2 C25.2 C26.2 C28.2 C30.1 C36.2 C37.2 C40.1 C41.1 D61.1(A) IC3.3(A:+IN) IC3.5(B:+IN) IC3.10(C:+IN) IC3.12(D:+IN) IC4.8(E:GND) IC8.3(A:+IN) IC8.5(B:+IN) IC8.10(C:+IN) IC8.12(D:+IN) IC9.3(A:+IN) IC9.5(B:+IN) J6.P1 J6.P2 J13.P1 R128.P$1(E) ; also sheet 1,2,3,4,6
IN_2_NORMALIZATION: R194.2 ; also sheet 2
N$1: IC9.6(B:-IN) R74.1 R78.2
N$2: IC5.10(C:IN) R44.2 R45.2 R46.2
N$5: IC8.6(B:-IN) R77.2 R79.1 R140.1
N$6: IC8.7(B:OUT) R73.1 R79.2 R140.2
N$9: IC9.7(B:OUT) R57.1 R74.2
N$10: IC4.7(B:IN) R48.2 R57.2 R71.2
N$11: C32.1 IC5.12(C:OUT) IC8.13(D:-IN) R69.1 R73.2
N$13: C19.1 R45.1
N$14: IC9.2(A:-IN) R72.1 R76.2 R197.1
N$16: C25.1 R48.1
N$17: C33.1 IC4.5(B:OUT) IC8.2(A:-IN) R68.1 R70.2
N$18: C23.1 D8.A IC3.9(C:-IN) IC5.5(B:OUT) R43.2
N$19: IC4.10(C:IN) R49.2 R52.2
N$23: J13.P3 R192.2
N$26: D8.C D10.A IC3.8(C:OUT)
N$34: C26.1 R49.1
N$58: IC8.8(C:OUT) IC8.9(C:-IN)
N$62: C11.1 IC3.2(A:-IN) R12.2 R16.1 R28.2 R29.2 R179.P$1(E)
N$65: D61.2(C) J6.P3 R186.1
N$67: R29.1 R128.P$2(S)
N$75: C24.1 D7.A IC3.6(B:-IN) IC4.12(C:OUT) R42.2
N$76: D7.C D9.A IC3.7(B:OUT)
N$83: IC5.7(B:IN) R47.2 R53.2
N$85: C28.1 R47.1
N$91: R179.P$2(S) R186.2
N$94: IC3.14(D:OUT) R12.1 R23.2
N$96: IC3.13(D:-IN) R23.1 R179.P$3(A)
N$98: R76.1 R198.1(E) R198.2(S)
N$106: IC4.1(E:MODE) R30.1
OUT: C32.2 IC8.14(D:OUT) R69.2 R192.1
OUT_1: R71.1 R198.3(A) ; also sheet 3,4
OUT_2: R44.1 R139.3(A) ; also sheet 3,4
RAW_IN_1: R78.1 ; also sheet 1
VCC: C14.1 C17.1 C36.1 C37.1 IC3.4(P:V+) IC4.16(E:V+) IC8.4(P:V+) IC9.8(P:V+) R30.2 ; also sheet 1,2,3,4,6
VEE: C16.2 C30.2 C40.2 C41.2 IC3.11(P:V-) IC4.9(E:V-) IC8.11(P:V-) IC9.4(P:V-) ; also sheet 1,2,3,4,6
ZZZZ: C33.2 IC8.1(A:OUT) R68.2 R194.1
Unconnected: J13.P2

### Notes on the sheet
- Even 10mVpp bleed is noticeable!
- cc-by-sa | Topology control
- Émilie Gillet
- emilie.o.gillet@gmail.com

## Sheet 6 of 6
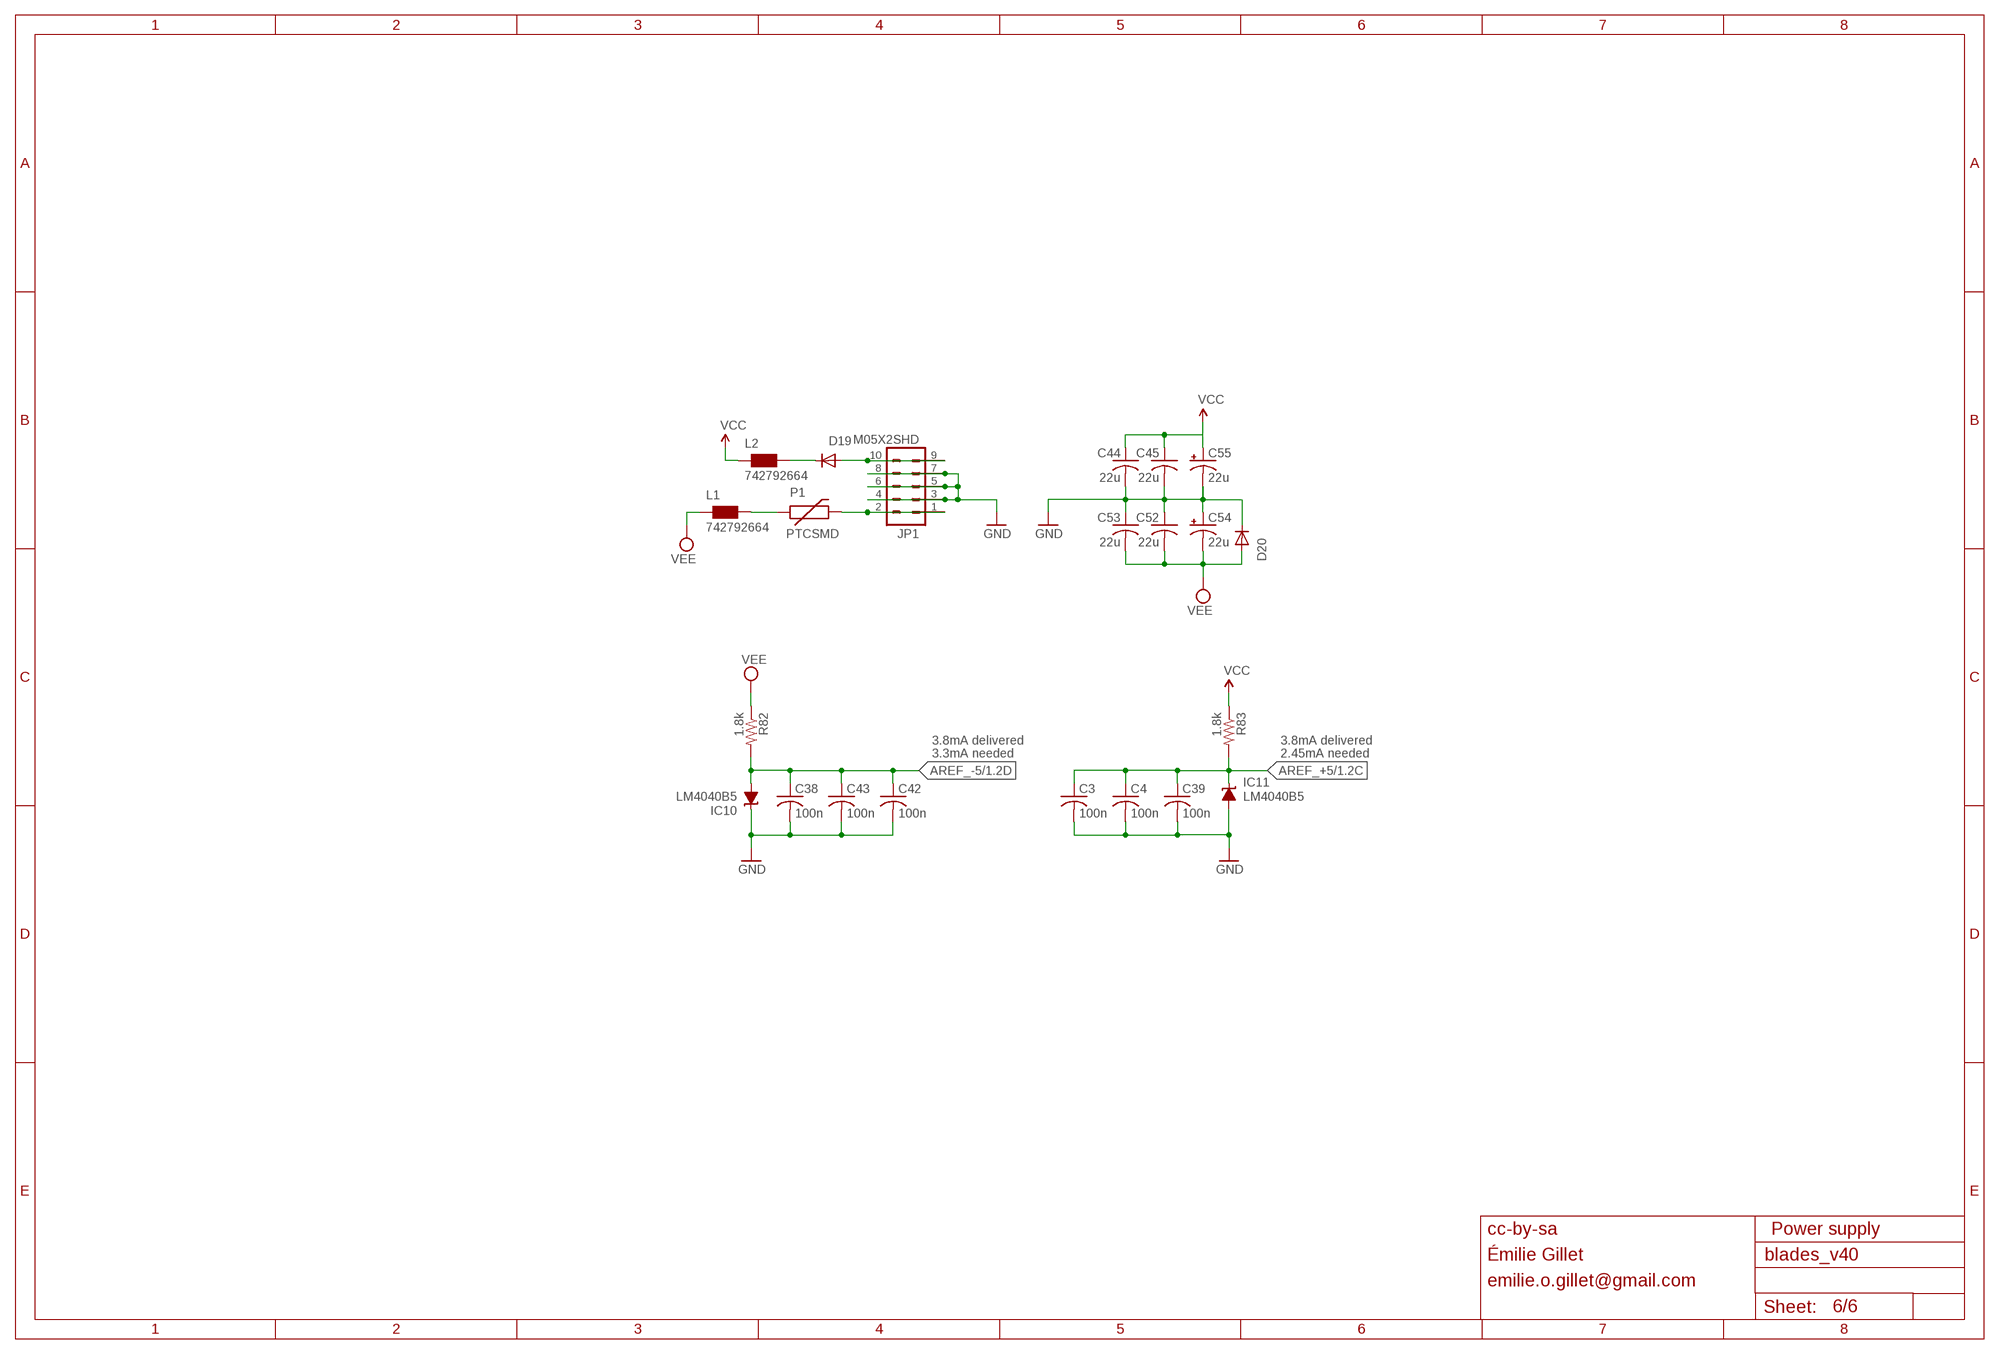
[diagram p5: schematic, sheet 6]

### Parts
C3  100n  C-USC0402  [C0402]
C4  100n  C-USC0402  [C0402]
C38  100n  C-USC0402  [C0402]
C39  100n  C-USC0402  [C0402]
C42  100n  C-USC0402  [C0402]
C43  100n  C-USC0402  [C0402]
C44  22u  C-USC1206  [C1206]
C45  22u  C-USC1206  [C1206]
C52  22u  C-USC1206  [C1206]
C53  22u  C-USC1206  [C1206]
C54  22u  CPOL-USB  [PANASONIC_B]
C55  22u  CPOL-USB  [PANASONIC_B]
D19  1N5819HW  DIODE-SOD123  [SOD123]
D20  1N5819HW  DIODE-SOD123  [SOD123]
IC10  LM4040B5  LM4041B12DBZ  [DBZ_R-PDSO-G3]
IC11  LM4040B5  LM4041B12DBZ  [DBZ_R-PDSO-G3]
JP1  M05X2SHD  [2X5-SHROUDED]
L1  742792664  WE-CBF_0603  [0603]
L2  742792664  WE-CBF_0603  [0603]
P1  PTCSMD  [PTC-1206]
R82  1.8k  R-US_R0402  [R0402]
R83  1.8k  R-US_R0402  [R0402]

### Nets
AREF_+5: C3.1 C4.1 C39.1 IC11.1(C) R83.2 ; also sheet 1,2,3,4,5
AREF_-5: C38.1 C42.1 C43.1 IC10.2(A) R82.2 ; also sheet 1,2,3,4,5
GND: C3.2 C4.2 C38.2 C39.2 C42.2 C43.2 C44.2 C45.2 C52.1 C53.1 C54.+ C55.- D20.C IC10.1(C) IC11.2(A) JP1.3 JP1.4 JP1.5 JP1.6 JP1.7 JP1.8 ; also sheet 1,2,3,4,5
N$53: JP1.1 JP1.2 P1.2
N$54: D19.A JP1.9 JP1.10
N$102: L1.2 P1.1
N$117: D19.C L2.2
VCC: C44.1 C45.1 C55.+ L2.1 R83.1 ; also sheet 1,2,3,4,5
VEE: C52.2 C53.2 C54.- D20.A L1.1 R82.1 ; also sheet 1,2,3,4,5

### Notes on the sheet
- 3.8mA delivered | 3.8mA delivered
- 3.3mA needed | 2.45mA needed
- cc-by-sa | Power supply
- Émilie Gillet
- emilie.o.gillet@gmail.com

## Library data of the parts
C1-C53 C56-C101 = rcl:C-US: CAPACITOR, American symbol
C54 C55 = rcl:CPOL-US: POLARIZED CAPACITOR, American symbol
D1-D48 = diode:DIODE-: DIODE
D49-D61 = og-diodes:TVS
IC1 IC2 IC8 IC14 IC15 IC18 IC21 = og-linear:OPA1679
IC3 IC19 IC20 = og-linear:TL074: OP AMP
IC4 IC5 IC12 IC13 IC16 IC17 = ssm2164:SSM2164
IC6 IC7 IC9 = og-linear:OPA1678
IC10 IC11 = texas:LM4041: PRECISION MICROPOWER SHUNT VOLTAGE REFERENCE Source: http://focus.ti.com/lit/ds/slcs146e/slcs146e.pdf
J1-J16 = og-pj301:PJ301_THONKICONN
JP1 = og-header:M05X2: Header 5x2 Standard 10-pin dual row 0.1" header. Commonly used with AVR-ISP. Use with Spark Fun Electronics SKU: PRT-00778
L1 L2 = wuerth-elektronik:WE-CBF: SMD EMI Suppression Ferrite Beads - excellent anti-EMI properties - low DCR - impedances till 3000 ohms - rated current up to 6 A
LED1 LED2 = led:LED: LED OSRAM: - CHIPLED LG R971, LG N971, LY N971, LG Q971, LY Q971, LO R971, LY R971 LH N974, LH R974 LS Q976, LO Q976, LY Q976 LO Q996 - Hyper CHIPLED LW Q18S LB Q993, LB Q99A, LB R99A - SideLED LS A670, LO A670, LY A670, LG A670, LP A670 LB A673, LV A673, LT A673, LW A673 LH A674 LY A675 LS A676, LA A676, LO A676, LY A676, LW A676 LS A679, LY A679, LG A679 - Hyper Micro SIDELED® LS Y876, LA Y876, LO Y876, LY Y876 LT Y87S - SmartLED LW L88C, LW L88S LB L89C, LB L89S, LG L890 LS L89K, LO L89K, LY L89K LS L896, LA L896, LO L896, LY L896 - TOPLED LS T670, LO T670, LY T670, LG T670, LP T670 LSG T670, LSP T670, LSY T670, LOP T670, LYG T670 LG T671, LOG T671, LSG T671 LB T673, LV T673, LT T673, LW T673 LH T674 LS T676, LA T676, LO T676, LY T676, LB T676, LH T676, LSB T676, LW T676 LB T67C, LV T67C, LT T67C, LS T67K, LO T67K, LY T67K, LW E67C LS E67B, LA E67B, LO E67B, LY E67B, LB E67C, LV E67C, LT E67C LW T67C LS T679, LY T679, LG T679 LS T770, LO T770, LY T770, LG T770, LP T770 LB T773, LV T773, LT T773, LW T773 LH T774 LS E675, LA E675, LY E675, LS T675 LS T776, LA T776, LO T776, LY T776, LB T776 LHGB T686 LT T68C, LB T68C - Hyper Mini TOPLED® LB M676 - Mini TOPLED Santana® LG M470 LS M47K, LO M47K, LY M47K Source: http://www.osram.convergy.de LUXEON: - LUMILED® LXK2-PW12-R00, LXK2-PW12-S00, LXK2-PW14-U00, LXK2-PW14-V00 LXK2-PM12-R00, LXK2-PM12-S00, LXK2-PM14-U00 LXK2-PE12-Q00, LXK2-PE12-R00, LXK2-PE12-S00, LXK2-PE14-T00, LXK2-PE14-U00 LXK2-PB12-K00, LXK2-PB12-L00, LXK2-PB12-M00, LXK2-PB14-N00, LXK2-PB14-P00, LXK2-PB14-Q00 LXK2-PR12-L00, LXK2-PR12-M00, LXK2-PR14-Q00, LXK2-PR14-R00 LXK2-PD12-Q00, LXK2-PD12-R00, LXK2-PD12-S00 LXK2-PH12-R00, LXK2-PH12-S00 LXK2-PL12-P00, LXK2-PL12-Q00, LXK2-PL12-R00 Source: www.luxeon.com KINGBRIGHT: KA-3528ASYC Source: www.kingbright.com
P1 = SparkFun:PTC: Resettable Fuse PTC Resettable Fuse. Spark Fun Electronics SKU : COM-08357
R1-R13 R16 R19-R79 R82-R85 R88-R126 R129 R131-R138 R140-R176 R182-R194 R197 R199 R200 = rcl:R-US_: RESISTOR, American symbol
R14 R15 R17 R18 R86 R87 R127 R128 R130 = pot-alps:POT_US
R80 R81 R177-R181 = og-pots:POT_US
R139 R195 R196 R198 = rcl:R-TRIMM: Trimm resistor
SW1 = og-switch:LP4OA1PBCT